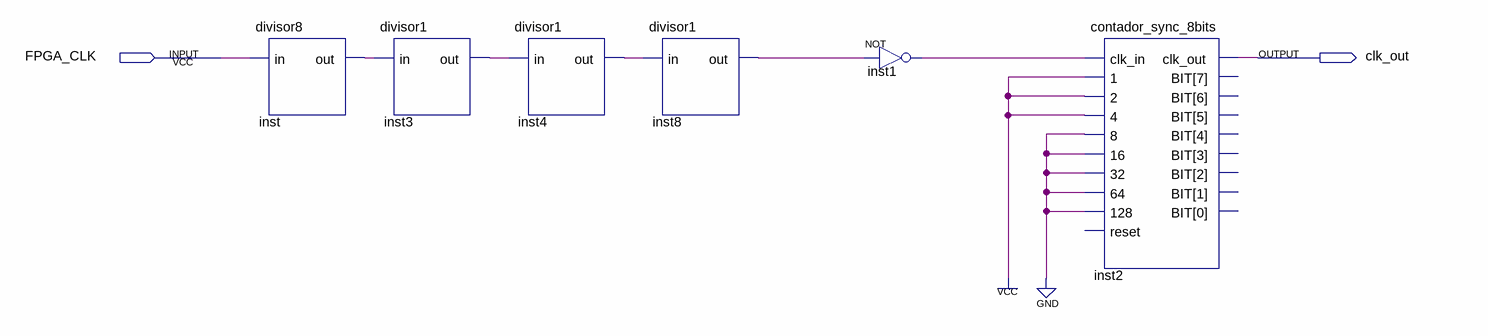
[diagram p0: schematic sheet]
// Quartus schematic freq_1760hz.bdf as structural Verilog: 6 symbols, 2 pins
module freq_1760hz (
  input  FPGA_CLK,
  output clk_out
);

  wire inst1_out, inst3_out, inst4_out, inst8_out, inst_out;

  divisor8 inst (.in(FPGA_CLK), .out(inst_out));
  divisor1 inst3 (.in(inst_out), .out(inst3_out));
  divisor1 inst4 (.in(inst3_out), .out(inst4_out));
  divisor1 inst8 (.in(inst4_out), .out(inst8_out));
  not inst1 (inst1_out, inst8_out);
  contador_sync_8bits inst2 (
    .clk_in(inst1_out), .\1 (1'b1), .\2 (1'b1), .\4 (1'b1), .\8 (1'b0), .\16 (1'b0), .\32 (1'b0),
    .\64 (1'b0), .\128 (1'b0), .clk_out(clk_out));  // open: reset, BIT
endmodule
